# Altium project Motion_detector_ESP32.PrjPcb
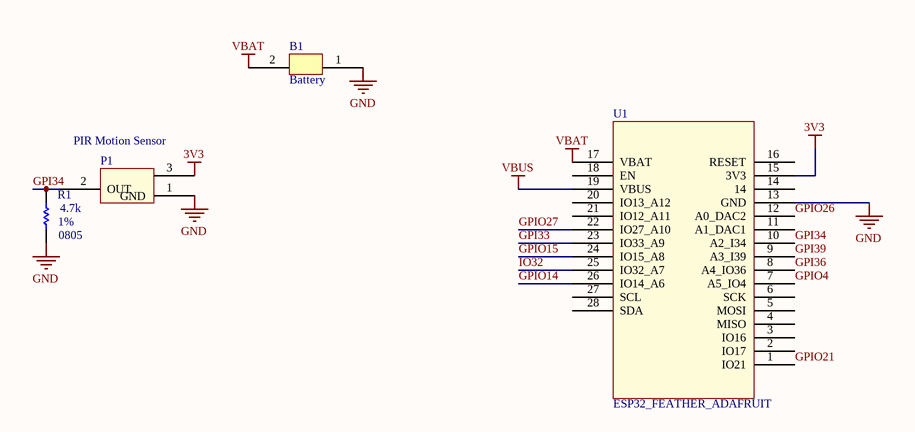
[diagram p0: Motion_detector_ESP32.SchDoc]
1 sheet, 4 parts. Net scope: global (net labels, ports and power ports of the same name join across sheets).
Board file: Motion_detector_ESP32.PcbDoc

## Sheet Motion_detector_ESP32.SchDoc
size A4

### Parts
B1  Battery  [battery-3.7V-1200mAh]
P1  PIR Motion Sensor  [EKMB1301111K]
R1  value 4.7k  Package: 0805  Precision: 1%  [RES_0805]  (hidden comment: RES - 0805)
U1  ESP32_FEATHER_ADAFRUIT  [ESP32_FEATHER]

### Nets
3V3: P1.3(VDD) U1.15(3V3)
GND: B1.1 P1.1(GND) R1.1 U1.13(GND)
VBAT: B1.2 U1.17(VBAT)
VBUS: U1.19(VBUS)
GPI33: U1.23(IO33_A9)
GPI34: P1.2(OUT) R1.2 U1.10(A2_I34)
GPI36: U1.8(A4_IO36)
GPI39: U1.9(A3_I39)
GPIO4: U1.7(A5_IO4)
GPIO14: U1.26(IO14_A6)
GPIO15: U1.24(IO15_A8)
GPIO21: U1.1(IO21)
GPIO26: U1.12(A0_DAC2)
GPIO27: U1.22(IO27_A10)
IO32: U1.25(IO32_A7)

Not connected (* = marked no-connect by the designer): U1 2(IO17) 3(IO16) 4(MISO) 5(MOSI) 6(SCK) 11(A1_DAC1) 14 16(RESET) 18(EN) 20(IO13_A12) 21(IO12_A11) 27(SCL) 28(SDA)

### Library data of the parts
P1 = PIR Motion Sensor: Sensor PIR (Passive Infrared) 197" (5m) 16.4' Polyethylene, White Lens
R1 = RES - 0805: Current: *; CreatedBy: Jonathan Bouchard